# EAGLE design timer-breakout (EAGLE 6.6.0)
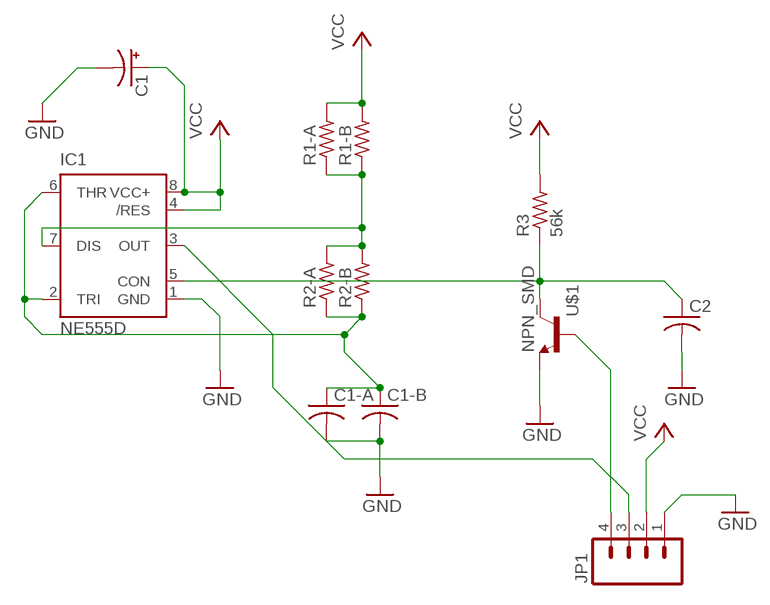
[diagram p0: schematic, sheet 1]

## Parts
C1  CAPACITOR_POLSMCD  [SMC_D]
C1-A  CAPACITORC1206K  [C1206K]
C1-B  CAPACITORC0805K  [C0805K]
C2  CAPACITORC1206K  [C1206K]
IC1  NE555D  [SO08]
JP1  M04PTH  [1X04]
R1-A  RESISTORR1206  [R1206]
R1-B  RESISTORR0805  [R0805]
R2-A  RESISTORR1206  [R1206]
R2-B  RESISTORR0805  [R0805]
R3  56k  RESISTORR0805  [R0805]
U$1  NPN_SMD  [SOT-23]

## Nets
GND: C1-A.2 C1-B.2 C1.- C2.2 IC1.1(GND) JP1.1 U$1.2(E)
N$1: C1-A.1 C1-B.1 IC1.2(TRI) IC1.6(THR) R2-A.1 R2-B.1
N$2: C2.1 IC1.5(CON) R3.1 U$1.3(C)
N$3: JP1.4 U$1.1(B)
N$4: IC1.7(DIS) R1-A.1 R1-B.1 R2-A.2 R2-B.2
N$5: IC1.3(OUT) JP1.3
VCC: C1.+ IC1.4(/RES) IC1.8(VCC+) JP1.2 R1-A.2 R1-B.2 R3.2

## Library data of the parts
C1 = iStivi - RCLD:CAPACITOR_POL: POLARIZED CAPACITOR, American symbol
C1-A C1-B C2 = iStivi - RCLD:CAPACITOR: CAPACITOR, American symbol
IC1 = iStivi - ICs:NE555: Timer General purpose bipolar Timer
JP1 = iStivi - Header-Connector:M04: Header 4 Standard 4-pin 0.1" header. Use with straight break away headers (SKU : PRT-00116), right angle break away headers (PRT-00553), swiss pins (PRT-00743), machine pins (PRT-00117), and female headers (PRT-00115). Molex polarized connector foot print use with SKU : PRT-08231 with associated crimp pins and housings. 1MM SMD Version SKU: PRT-10208
R1-A R1-B R2-A R2-B R3 = iStivi - RCLD:RESISTOR: RESISTOR
U$1 = iStivi - Transistor-FET-reg:NPN_SMD: NPN Transistor NPN transistor with smd package BC817 PMBTA42

## Board
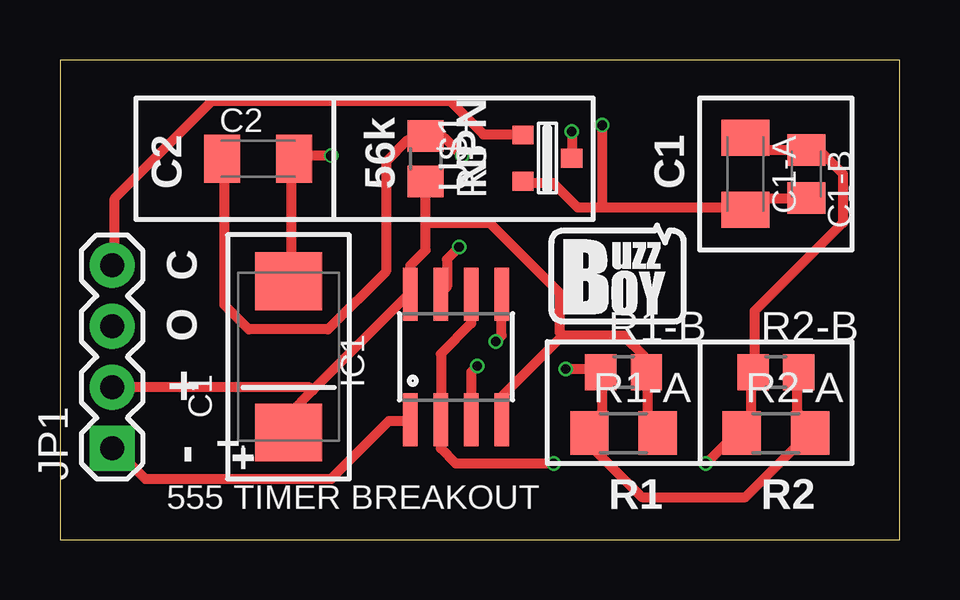
[diagram p1: board, top side]
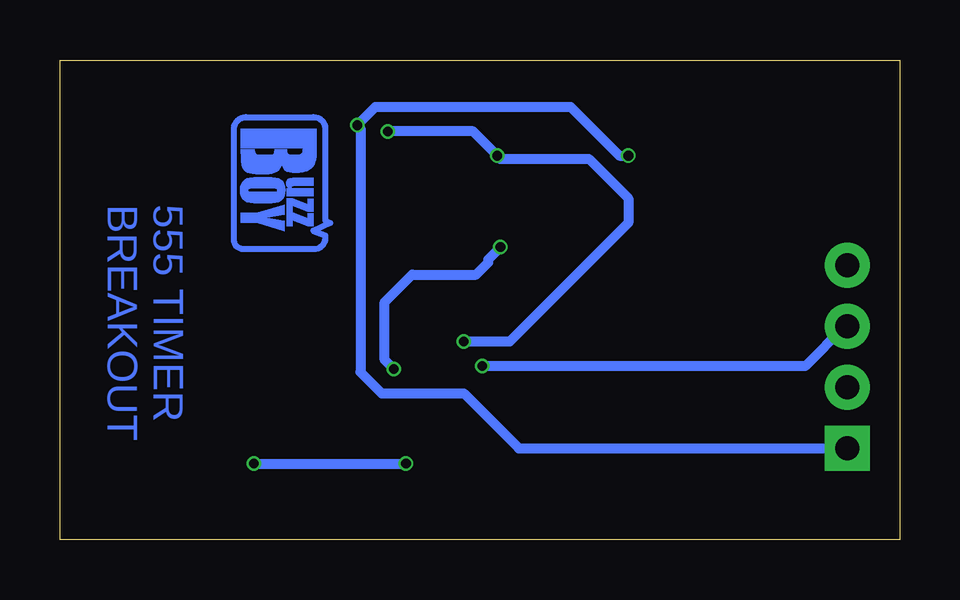
[diagram p2: board, bottom side, seen from below]

Size 35 x 19.99 mm. Coordinates in mm from the lower left corner, seen from the top.
Outline: 0,0 35,0 35,19.99 0,19.99 0,0
Copper layers (1*16): Top 0.035mm / dielectric 1.5mm / Bottom 0.035mm
Design rules "doubletube *": minimum track width 16mil, minimum drill 0.4mm, track to track 20mil, track to pad 20mil, pad to pad 8mil, via to via 8mil, smd to smd 8mil, copper to edge 40mil, drill to drill 8mil, minimum pad ring 10mil, minimum via ring 4mil, stop-mask expansion 4mil, vias tented up to drill 0.5mm, thermal gap 10mil

### Footprints (pad centres in the part's own frame; a part is rotated, then mirrored left to right if it is on the bottom)
SMC_D = smd 2.4 x 2.8: + -3.15,0; - 3.15,0
C1206K = smd 1.5 x 2: 1 -1.5,0; 2 1.5,0
C0805K = smd 1.3 x 1.6: 1 -1,0; 2 1,0
SO08 = smd 0.61 x 2.21: 1 -1.905,-2.616; 2 -0.635,-2.616; 3 0.635,-2.616; 4 1.905,-2.616; 5 1.905,2.616; 6 0.635,2.616; 7 -0.635,2.616; 8 -1.905,2.616
1X04 = drill 1 pad 1.88 square: 1 0,0 | drill 1 pad 1.88: 2 2.54,0; 3 5.08,0; 4 7.62,0
R1206 = smd 1.6 x 1.803: 1 -1.422,0; 2 1.422,0
R0805 = smd 1.3 x 1.5: 1 -0.95,0; 2 0.95,0
SOT-23 = smd 0.787 x 0.889: 1 0.991,1.016; 2 -0.94,1.016; 3 0.025,-1.016

### Placement (x,y rotation side)
C1  9.53,7.62 90 top
C1-A  28.57,15.24 270 top
C1-B  31.11,15.24 270 top
C2  8.26,15.88 0 top
IC1  16.51,7.62 0 top
JP1  2.17,3.81 90 top
R1-A  23.5,4.45 0 top
R1-B  23.5,6.99 0 top
R2-A  29.84,4.45 0 top
R2-B  29.84,6.99 0 top
R3  15.24,15.88 270 top
U$1  20.32,15.88 90 top
U$2  [BUZZBOY-SILK]  22.86,11.43 0 top
U$3  [BUZZBOY]  27.94,17.78 270 bottom

### Tracks (layer width: path | path; a pad name or v marks a point on that pad's centre or on a via)
GND  (via drill 0.4)
  Top 0.406: IC1.1 14.61,4.95 13.72,4.95 11.3,2.54 3.56,2.54 2.29,3.81 JP1.1 | C1.- 9.53,10.79 9.65,10.92 9.65,15.88 C2.2 9.91,16 v11.3,16 | 22.61,13.84 28.57,13.84 C1-A.2 28.7,13.97 28.96,14.22 31.11,14.22 C1-B.2 | 22.61,13.84 21.59,13.84 20.57,14.86 19.3,14.86 U$1.2 | 22.61,13.84 v22.61,17.27
  Bottom 0.406: v11.3,16 11.68,16 13.72,18.03 21.84,18.03 v22.61,17.27 22.48,17.14 22.48,6.99 21.59,6.1 18.16,6.1 15.88,3.81 JP1.1
N$1  (via drill 0.4)
  Top 0.406: IC1.6 17.14,9.02 15.88,7.75 IC1.2 15.88,3.81 16.51,3.17 v20.57,3.17 | C1-A.1 28.57,16.64 28.96,16.26 31.11,16.26 C1-B.1 31.24,16.13 31.75,16.13 32.64,15.24 32.64,13.21 28.96,9.53 28.96,7.11 R2-B.1 28.83,6.99 28.83,4.83 28.45,4.45 R2-A.1 28.32,4.57 v26.92,3.17
  Bottom 0.406: v26.92,3.17 v20.57,3.17
N$2  (via drill 0.4)
  Top 0.406: v21.34,17.02 U$1.3 | v16.76,16 16,16.76 15.24,16.76 R3.1 15.11,16.64 14.48,16.64 13.59,15.75 13.59,11.18 11.18,8.76 7.87,8.76 6.86,9.78 6.86,15.88 C2.1 | IC1.5 18.41,8.51 v18.16,8.26
  Bottom 0.406: v21.34,17.02 17.78,17.02 v16.76,16 16.64,15.88 12.95,15.88 11.3,14.22 11.3,13.21 16.26,8.26 v18.16,8.26
N$3
  Top 0.406: U$1.1 19.3,16.89 17.65,16.89 16.26,18.29 6.35,18.29 2.29,14.22 2.29,11.43 JP1.4
N$4  (via drill 0.4)
  Top 0.406: R2-B.2 30.73,6.99 30.73,5.33 31.24,4.83 31.24,4.45 R2-A.2 31.11,4.32 28.57,1.78 24.26,1.78 22.1,3.94 22.1,4.32 R1-A.1 22.1,4.45 22.1,4.83 22.61,5.33 22.61,6.99 R1-B.1 22.48,7.11 v21.08,7.11 | v16.64,12.19 16.13,11.68 16.13,10.54 15.88,10.29 IC1.7
  Bottom 0.406: v16.64,12.19 17.14,11.68 17.14,11.56 17.65,11.05 20.32,11.05 21.46,9.91 21.46,7.49 v21.08,7.11
N$5  (via drill 0.4)
  Top 0.406: IC1.3 17.14,6.99 v17.4,7.24
  Bottom 0.406: v17.4,7.24 3.94,7.24 2.29,8.89 JP1.3
VCC
  Top 0.406: R1-A.2 24.89,4.45 24.51,4.83 24.51,6.99 R1-B.2 24.38,7.11 24.38,7.62 23.5,8.51 20.95,8.51 | IC1.4 18.41,5.97 20.95,8.51 | 15.24,13.21 15.24,12.06 14.61,11.43 IC1.8 14.48,10.16 10.54,6.22 | 15.24,13.21 R3.2 | C1.+ 9.53,5.21 10.54,6.22 | JP1.2 10.41,6.35 10.54,6.22 | 15.24,13.21 17.91,13.21 20.83,10.29 20.83,8.64 20.95,8.51

### Text on the board
Bottom: 555 TIMER / BREAKOUT
_tplace: C2 | 56k | NPN | C1 | C | O | + | - | + | + | 555 TIMER BREAKOUT | R1 | R2